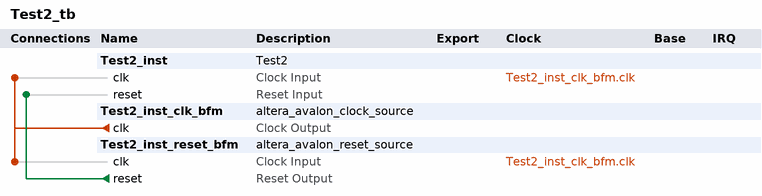
[diagram p0: system contents]
# Platform Designer (Qsys) system Test2_tb, Cyclone II EP2C5T144C6
# Parameters at their usual value, and those the tool derives, are not listed.
package require -exact qsys 13.0
create_system Test2_tb
set_project_property DEVICE_FAMILY {Cyclone II}
set_project_property DEVICE EP2C5T144C6

add_instance Test2_inst Test2 1.0

add_instance Test2_inst_clk_bfm altera_avalon_clock_source 13.0

add_instance Test2_inst_reset_bfm altera_avalon_reset_source 13.0
set_instance_parameter_value Test2_inst_reset_bfm ASSERT_HIGH_RESET 0
set_instance_parameter_value Test2_inst_reset_bfm INITIAL_RESET_CYCLES 50

# connections
add_connection Test2_inst_clk_bfm.clk Test2_inst.clk clock
add_connection Test2_inst_clk_bfm.clk Test2_inst_reset_bfm.clk clock
add_connection Test2_inst_reset_bfm.reset Test2_inst.reset reset

set_interconnect_requirement {$system} qsys_mm.clockCrossingAdapter HANDSHAKE
set_interconnect_requirement {$system} qsys_mm.maxAdditionalLatency 1

save_system Test2_tb.qsys
